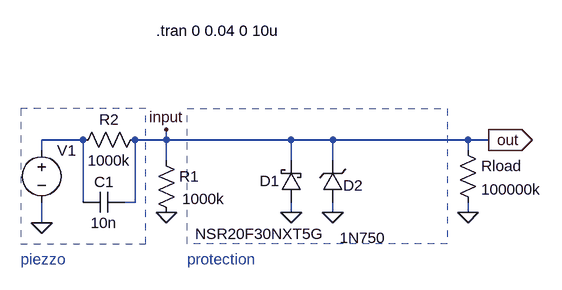
[diagram p0: schematic piezzo protection.asc]
piezzo protection.asc, the LTspice schematic file:
Version 4
SHEET 1 880 680
WIRE -176 176 -240 176
WIRE -48 176 -48 160
WIRE -48 176 -96 176
WIRE 144 176 -48 176
WIRE 208 176 144 176
WIRE 416 176 208 176
WIRE 448 176 416 176
WIRE -240 192 -240 176
WIRE 416 192 416 176
WIRE -48 208 -48 176
WIRE 144 208 144 176
WIRE 208 208 208 176
WIRE -176 272 -176 176
WIRE -96 272 -96 176
WIRE -96 272 -112 272
WIRE 144 288 144 272
WIRE 208 288 208 272
WIRE 416 288 416 272
WIRE -240 304 -240 272
FLAG -240 304 0
FLAG 144 288 0
FLAG 208 288 0
FLAG 416 288 0
FLAG 448 176 out
IOPIN 448 176 Out
FLAG -48 160 input
FLAG -48 288 0
SYMBOL schottky 160 272 R180
WINDOW 0 34 33 Left 2
WINDOW 3 -36 -49 Left 2
SYMATTR InstName D1
SYMATTR Value NSR20F30NXT5G
SYMATTR Description Diode
SYMATTR Type diode
SYMBOL zener 224 272 R180
WINDOW 0 -31 26 Left 2
WINDOW 3 -66 -55 Left 2
SYMATTR InstName D2
SYMATTR Value 1N750
SYMBOL voltage -240 176 R0
WINDOW 3 24 96 Invisible 2
WINDOW 123 0 0 Left 2
WINDOW 39 0 0 Left 2
SYMATTR Value SINE(0 10 4000 0 0 0 0)
SYMATTR InstName V1
SYMBOL res 400 176 R0
SYMATTR InstName Rload
SYMATTR Value 100000k
SYMBOL cap -176 288 R270
WINDOW 0 32 32 VTop 2
WINDOW 3 0 32 VBottom 2
SYMATTR InstName C1
SYMATTR Value 10n
SYMBOL res -64 192 R0
WINDOW 3 40 75 Left 2
SYMATTR InstName R1
SYMATTR Value 1000k
SYMBOL res -80 160 R90
WINDOW 0 0 56 VBottom 2
WINDOW 3 32 56 VTop 2
SYMATTR InstName R2
SYMATTR Value 1000k
TEXT -64 8 Left 2 !.tran 0 0.04 0 10u
TEXT -272 360 Left 2 ;piezzo
TEXT -16 360 Left 2 ;protection
RECTANGLE Normal -272 336 -80 128 2
RECTANGLE Normal 384 336 -16 128 2

The netlist it stands for:
* piezzo protection.asc
D1 0 input NSR20F30NXT5G
D2 0 input 1N750
V1 N001 0 SINE(0 10 4000 0 0 0 0)
Rload input 0 100000k
C1 N001 input 10n
R1 input 0 1000k
R2 input N001 1000k
.model D D
.lib standard.dio
.tran 0 0.04 0 10u
* piezzo
* protection
.backanno
.end